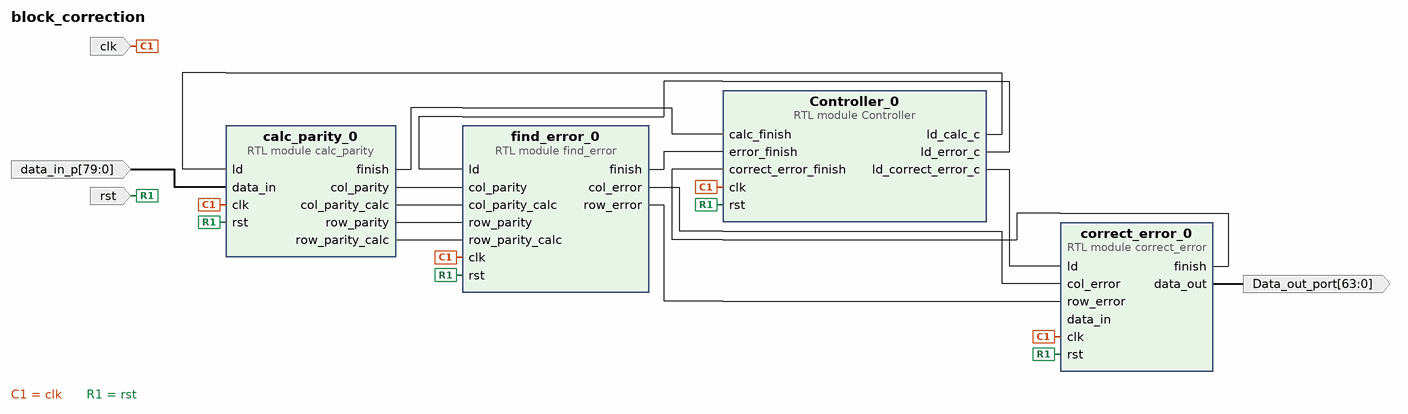
[diagram p0: block diagram of the top level]
# Vivado block design block_correction, xc7z020clg400-1, Vivado 2023.1
create_bd_design block_correction

create_bd_port -dir O -from 63 -to 0 Data_out_port
create_bd_port -dir I -from 79 -to 0 data_in_p
create_bd_port -dir I clk
create_bd_port -dir I rst

create_bd_cell -type module -reference correct_error correct_error_0
create_bd_cell -type module -reference calc_parity calc_parity_0
create_bd_cell -type module -reference Controller Controller_0
create_bd_cell -type module -reference find_error find_error_0

# ---- connections ----

connect_bd_net [get_bd_pins Controller_0/ld_calc_c] [get_bd_pins calc_parity_0/ld]
connect_bd_net [get_bd_pins Controller_0/ld_correct_error_c] [get_bd_pins correct_error_0/ld]
connect_bd_net [get_bd_pins Controller_0/ld_error_c] [get_bd_pins find_error_0/ld]
connect_bd_net [get_bd_ports clk] \
  [get_bd_pins correct_error_0/clk] [get_bd_pins calc_parity_0/clk] [get_bd_pins Controller_0/clk] \
  [get_bd_pins find_error_0/clk]
connect_bd_net [get_bd_ports rst] \
  [get_bd_pins correct_error_0/rst] [get_bd_pins calc_parity_0/rst] [get_bd_pins Controller_0/rst] \
  [get_bd_pins find_error_0/rst]
connect_bd_net [get_bd_pins calc_parity_0/finish] [get_bd_pins Controller_0/calc_finish]
connect_bd_net [get_bd_pins calc_parity_0/col_parity] [get_bd_pins find_error_0/col_parity]
connect_bd_net [get_bd_pins calc_parity_0/col_parity_calc] [get_bd_pins find_error_0/col_parity_calc]
# net calc_parity_0_data_out has one end: correct_error_0/data_in
connect_bd_net [get_bd_pins calc_parity_0/row_parity] [get_bd_pins find_error_0/row_parity]
connect_bd_net [get_bd_pins calc_parity_0/row_parity_calc] [get_bd_pins find_error_0/row_parity_calc]
connect_bd_net [get_bd_pins correct_error_0/finish] [get_bd_pins Controller_0/correct_error_finish]
connect_bd_net [get_bd_pins correct_error_0/data_out] [get_bd_ports Data_out_port]
connect_bd_net [get_bd_ports data_in_p] [get_bd_pins calc_parity_0/data_in]
connect_bd_net [get_bd_pins find_error_0/finish] [get_bd_pins Controller_0/error_finish]
connect_bd_net [get_bd_pins find_error_0/col_error] [get_bd_pins correct_error_0/col_error]
connect_bd_net [get_bd_pins find_error_0/row_error] [get_bd_pins correct_error_0/row_error]

validate_bd_design
save_bd_design
